# EAGLE design AHNS_AP_MK4 (EAGLE 5.10)
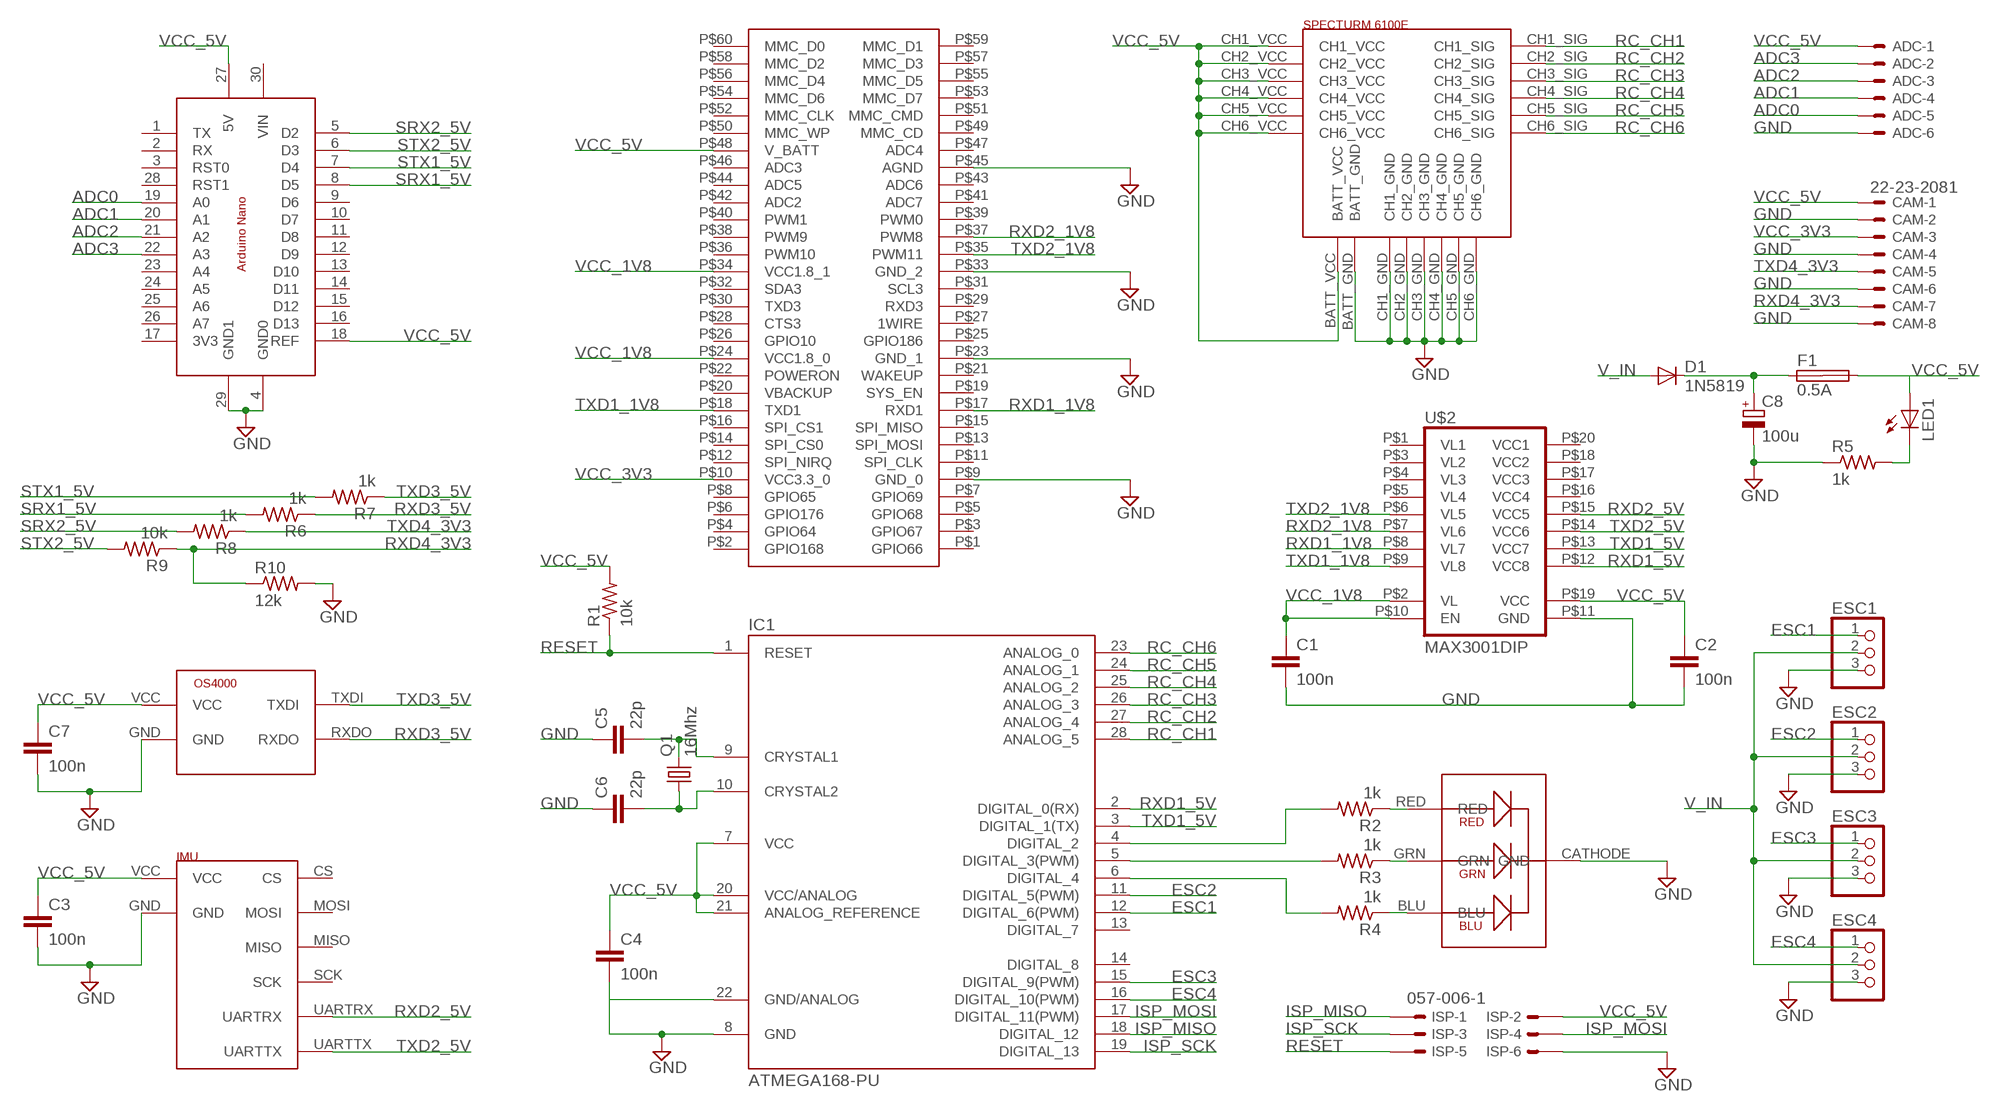
[diagram p0: schematic, sheet 1]

## Parts
ADC  22-23-2061  [22-23-2061]
C1  100n  C-EU050-024X044  [C050-024X044]
C2  100n  C-EU050-024X044  [C050-024X044]
C3  100n  C-EU050-024X044  [C050-024X044]
C4  100n  C-EU050-024X044  [C050-024X044]
C5  22p  C-EU050-024X044  [C050-024X044]
C6  22p  C-EU050-024X044  [C050-024X044]
C7  100n  C-EU050-024X044  [C050-024X044]
C8  100u  CPOL-EUE2.5-5  [E2,5-5]
CAM  22-23-2081  [22-23-2081]
D1  1N5819  1N4004  [DO41-10]
ESC1  PINHD-1X3  [1X03]
ESC2  PINHD-1X3  [1X03]
ESC3  PINHD-1X3  [1X03]
ESC4  PINHD-1X3  [1X03]
F1  0.5A  SHK20L  [SHK20L]
IC1  ATMEGA168-PU  [DIL28-3]
ISP  057-006-1  [057-006-1]
LED1  LED3MM  [LED3MM]
Q1  16Mhz  CRYSTALHC49U70  [HC49U70]
R1  10k  R-US_0207/10  [0207/10]
R2  1k  R-US_0207/10  [0207/10]
R3  1k  R-US_0207/10  [0207/10]
R4  1k  R-US_0207/10  [0207/10]
R5  1k  R-US_0207/10  [0207/10]
R6  1k  R-US_0207/10  [0207/10]
R7  1k  R-US_0207/10  [0207/10]
R8  1k  R-US_0207/10  [0207/10]
R9  10k  R-US_0207/10  [0207/10]
R10  12k  R-US_0207/10  [0207/10]
U$1  PINTO  [PINTO]
U$2  MAX3001DIP  [DIP]
U$3  SEN_DYN_6DOF_IMU  [SEN_DYN_6DOF_IMU]
U$4  SPECTRUM_6100E  [SPECTRUM_6100E]
U$5  TRI_COLOR_LED  [TRI_COLOR_LED]
U$6  ARDUINO_NANO  [ARDUINO_NANO]
U$7  OS4000  [OS4000]

## Nets
ADC0: ADC.5 U$6.19(A0)
ADC1: ADC.4 U$6.20(A1)
ADC2: ADC.3 U$6.21(A2)
ADC3: ADC.2 U$6.22(A3)
ESC1: ESC1.1 IC1.12(DIGITAL_6(PWM))
ESC2: ESC2.1 IC1.11(DIGITAL_5(PWM))
ESC3: ESC3.1 IC1.15(DIGITAL_9(PWM))
ESC4: ESC4.1 IC1.16(DIGITAL_10(PWM))
GND: ADC.6 C1.2 C2.2 C3.2 C4.2 C5.1 C6.1 C7.2 C8.- CAM.2 CAM.4 CAM.6 CAM.8 ESC1.3 ESC2.3 ESC3.3 ESC4.3 IC1.8(GND) IC1.22(GND/ANALOG) ISP.6 R5.1 R10.2 U$1.P$9(GND_0) U$1.P$23(GND_1) U$1.P$33(GND_2) U$1.P$45(AGND) U$2.P$11(GND) U$3.GND U$4.BATT_GND U$4.CH1_GND U$4.CH2_GND U$4.CH3_GND U$4.CH4_GND U$4.CH5_GND U$4.CH6_GND U$5.CATHODE(GND) U$6.4(GND0) U$6.29(GND1) U$7.GND
ISP_MISO: IC1.18(DIGITAL_12) ISP.1
ISP_MOSI: IC1.17(DIGITAL_11(PWM)) ISP.4
ISP_SCK: IC1.19(DIGITAL_13) ISP.3
N$1: C5.2 IC1.9(CRYSTAL1) Q1.2
N$2: R2.1 U$5.RED
N$3: C6.2 IC1.10(CRYSTAL2) Q1.1
N$4: R3.1 U$5.GRN
N$5: R4.1 U$5.BLU
N$6: IC1.5(DIGITAL_3(PWM)) R3.2
N$7: IC1.4(DIGITAL_2) R2.2
N$8: IC1.6(DIGITAL_4) R4.2
N$9: C8.+ D1.C F1.1A
N$10: LED1.K(C) R5.2
RC_CH1: IC1.28(ANALOG_5) U$4.CH1_SIG
RC_CH2: IC1.27(ANALOG_4) U$4.CH2_SIG
RC_CH3: IC1.26(ANALOG_3) U$4.CH3_SIG
RC_CH4: IC1.25(ANALOG_2) U$4.CH4_SIG
RC_CH5: IC1.24(ANALOG_1) U$4.CH5_SIG
RC_CH6: IC1.23(ANALOG_0) U$4.CH6_SIG
RESET: IC1.1(RESET) ISP.5 R1.1
RXD1_1V8: U$1.P$17(RXD1) U$2.P$8(VL7)
RXD1_5V: IC1.2(DIGITAL_0(RX)) U$2.P$12(VCC8)
RXD2_1V8: U$1.P$37(PWM8) U$2.P$7(VL6)
RXD2_5V: U$2.P$15(VCC5) U$3.UARTRX
RXD3_5V: R6.1 U$7.RXDO
RXD4_3V3: CAM.7 R9.1 R10.1
SRX1_5V: R6.2 U$6.8(D5)
SRX2_5V: R8.2 U$6.5(D2)
STX1_5V: R7.2 U$6.7(D4)
STX2_5V: R9.2 U$6.6(D3)
TXD1_1V8: U$1.P$18(TXD1) U$2.P$9(VL8)
TXD1_5V: IC1.3(DIGITAL_1(TX)) U$2.P$13(VCC7)
TXD2_1V8: U$1.P$35(PWM11) U$2.P$6(VL5)
TXD2_5V: U$2.P$14(VCC6) U$3.UARTTX
TXD3_5V: R7.1 U$7.TXDI
TXD4_3V3: CAM.5 R8.1
V_IN: D1.A ESC1.2 ESC2.2 ESC3.2 ESC4.2
VCC_1V8: C1.1 U$1.P$24(VCC1.8_0) U$1.P$34(VCC1.8_1) U$2.P$2(VL) U$2.P$10(EN)
VCC_3V3: CAM.3 U$1.P$10(VCC3.3_0)
VCC_5V: ADC.1 C2.1 C3.1 C4.1 C7.1 CAM.1 F1.2A IC1.7(VCC) IC1.20(VCC/ANALOG) IC1.21(ANALOG_REFERENCE) ISP.2 LED1.A R1.2 U$1.P$48(V_BATT) U$2.P$19(VCC) U$3.VCC U$4.BATT_VCC U$4.CH1_VCC U$4.CH2_VCC U$4.CH3_VCC U$4.CH4_VCC U$4.CH5_VCC U$4.CH6_VCC U$6.18(REF) U$6.27(5V) U$7.VCC
Unconnected: F1.1B F1.2B IC1.13(DIGITAL_7) IC1.14(DIGITAL_8) U$1.P$1(GPIO66) U$1.P$2(GPIO168) U$1.P$3(GPIO67) U$1.P$4(GPIO64) U$1.P$5(GPIO68) U$1.P$6(GPIO176) U$1.P$7(GPIO69) U$1.P$8(GPIO65) U$1.P$11(SPI_CLK) U$1.P$12(SPI_NIRQ) U$1.P$13(SPI_MOSI) U$1.P$14(SPI_CS0) U$1.P$15(SPI_MISO) U$1.P$16(SPI_CS1) U$1.P$19(SYS_EN) U$1.P$20(VBACKUP) U$1.P$21(WAKEUP) U$1.P$22(POWERON) U$1.P$25(GPIO186) U$1.P$26(GPIO10) U$1.P$27(1WIRE) U$1.P$28(CTS3) U$1.P$29(RXD3) U$1.P$30(TXD3) U$1.P$31(SCL3) U$1.P$32(SDA3) U$1.P$36(PWM10) U$1.P$38(PWM9) U$1.P$39(PWM0) U$1.P$40(PWM1) U$1.P$41(ADC7) U$1.P$42(ADC2) U$1.P$43(ADC6) U$1.P$44(ADC5) U$1.P$46(ADC3) U$1.P$47(ADC4) U$1.P$49(MMC_CD) U$1.P$50(MMC_WP) U$1.P$51(MMC_CMD) U$1.P$52(MMC_CLK) U$1.P$53(MMC_D7) U$1.P$54(MMC_D6) U$1.P$55(MMC_D5) U$1.P$56(MMC_D4) U$1.P$57(MMC_D3) U$1.P$58(MMC_D2) U$1.P$59(MMC_D1) U$1.P$60(MMC_D0) U$2.P$1(VL1) U$2.P$3(VL2) U$2.P$4(VL3) U$2.P$5(VL4) U$2.P$16(VCC4) U$2.P$17(VCC3) U$2.P$18(VCC2) U$2.P$20(VCC1) U$3.CS U$3.MISO U$3.MOSI U$3.SCK U$6.1(TX) U$6.2(RX) U$6.3(RST0) U$6.9(D6) U$6.10(D7) U$6.11(D8) U$6.12(D9) U$6.13(D10) U$6.14(D11) U$6.15(D12) U$6.16(D13) U$6.17(3V3) U$6.23(A4) U$6.24(A5) U$6.25(A6) U$6.26(A7) U$6.28(RST1) U$6.30(VIN)

## Library data of the parts
ADC = con-molex:22-23-2061: .100" (2.54mm) Center Header - 6 Pin
C1-C7 = rcl:C-EU: CAPACITOR, European symbol
C8 = rcl:CPOL-EU: POLARIZED CAPACITOR, European symbol
CAM = con-molex:22-23-2081: .100" (2.54mm) Center Header - 8 Pin
D1 = diode:1N4004: DIODE general purpose rectifier, 1 A
ESC1-ESC4 = pinhead:PINHD-1X3: PIN HEADER
F1 = fuse:SHK20L: FUSE HOLDER 5 x 20 mm, SH contact, SHH1 Schukat, E1073 Buerklin
IC1 = Arduino-AVR:ATMEGA168-PU
ISP = con-panduit:057-006-: CONNECTOR 6-pin series 057 contact pc board low profile headers
LED1 = led:LED: LED OSRAM: - CHIPLED LG R971, LG N971, LY N971, LG Q971, LY Q971, LO R971, LY R971 LH N974, LH R974 LS Q976, LO Q976, LY Q976 LO Q996 - Hyper CHIPLED LW Q18S LB Q993, LB Q99A, LB R99A - SideLED LS A670, LO A670, LY A670, LG A670, LP A670 LB A673, LV A673, LT A673, LW A673 LH A674 LY A675 LS A676, LA A676, LO A676, LY A676, LW A676 LS A679, LY A679, LG A679 - Hyper Micro SIDELED® LS Y876, LA Y876, LO Y876, LY Y876 LT Y87S - SmartLED LW L88C, LW L88S LB L89C, LB L89S, LG L890 LS L89K, LO L89K, LY L89K LS L896, LA L896, LO L896, LY L896 - TOPLED LS T670, LO T670, LY T670, LG T670, LP T670 LSG T670, LSP T670, LSY T670, LOP T670, LYG T670 LG T671, LOG T671, LSG T671 LB T673, LV T673, LT T673, LW T673 LH T674 LS T676, LA T676, LO T676, LY T676, LB T676, LH T676, LSB T676, LW T676 LB T67C, LV T67C, LT T67C, LS T67K, LO T67K, LY T67K, LW E67C LS E67B, LA E67B, LO E67B, LY E67B, LB E67C, LV E67C, LT E67C LW T67C LS T679, LY T679, LG T679 LS T770, LO T770, LY T770, LG T770, LP T770 LB T773, LV T773, LT T773, LW T773 LH T774 LS E675, LA E675, LY E675, LS T675 LS T776, LA T776, LO T776, LY T776, LB T776 LHGB T686 LT T68C, LB T68C - Hyper Mini TOPLED® LB M676 - Mini TOPLED Santana® LG M470 LS M47K, LO M47K, LY M47K Source: http://www.osram.convergy.de LUXEON: - LUMILED® LXK2-PW12-R00, LXK2-PW12-S00, LXK2-PW14-U00, LXK2-PW14-V00 LXK2-PM12-R00, LXK2-PM12-S00, LXK2-PM14-U00 LXK2-PE12-Q00, LXK2-PE12-R00, LXK2-PE12-S00, LXK2-PE14-T00, LXK2-PE14-U00 LXK2-PB12-K00, LXK2-PB12-L00, LXK2-PB12-M00, LXK2-PB14-N00, LXK2-PB14-P00, LXK2-PB14-Q00 LXK2-PR12-L00, LXK2-PR12-M00, LXK2-PR14-Q00, LXK2-PR14-R00 LXK2-PD12-Q00, LXK2-PD12-R00, LXK2-PD12-S00 LXK2-PH12-R00, LXK2-PH12-S00 LXK2-PL12-P00, LXK2-PL12-Q00, LXK2-PL12-R00 Source: www.luxeon.com KINGBRIGHT: KA-3528ASYC Source: www.kingbright.com
Q1 = crystal:CRYSTAL: CRYSTAL
R1-R10 = rcl:R-US_: RESISTOR, American symbol
U$1 = AHNS10:PINTO
U$2 = maxim-11:MAX3001DIP
U$3 = AHNS10:SEN_DYN_6DOF_IMU
U$4 = AHNS10:SPECTRUM_6100E
U$5 = AHNS10:TRI_COLOR_LED
U$6 = AHNS10:ARDUINO_NANO
U$7 = AHNS10:OS4000

## Board
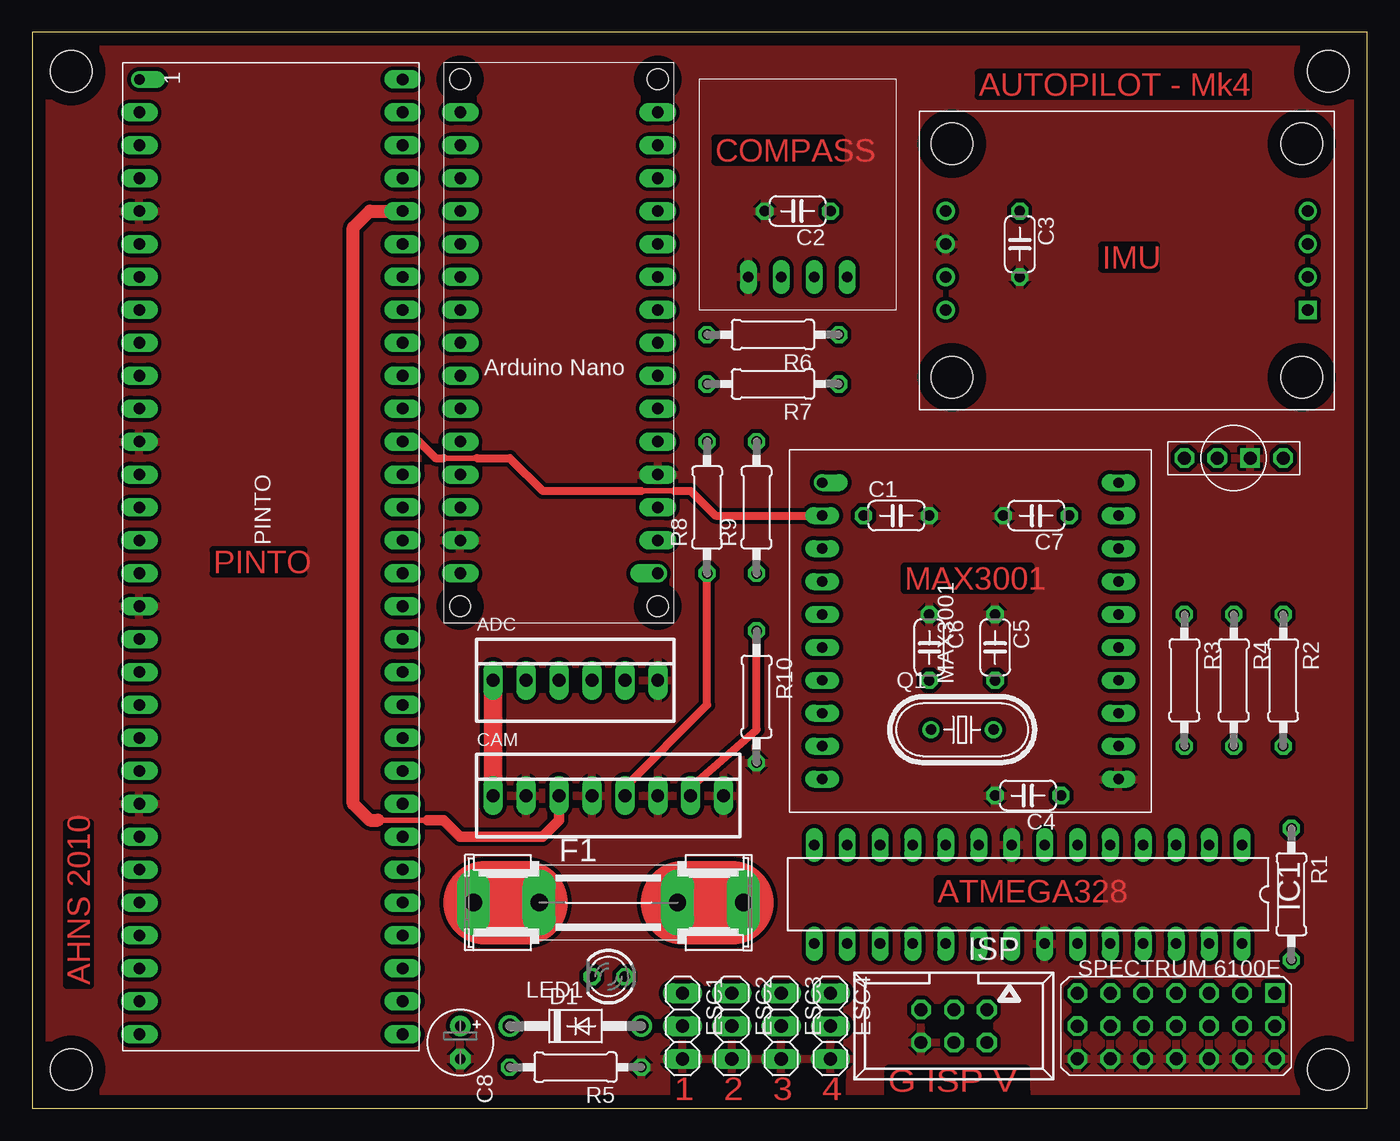
[diagram p1: board, top side]
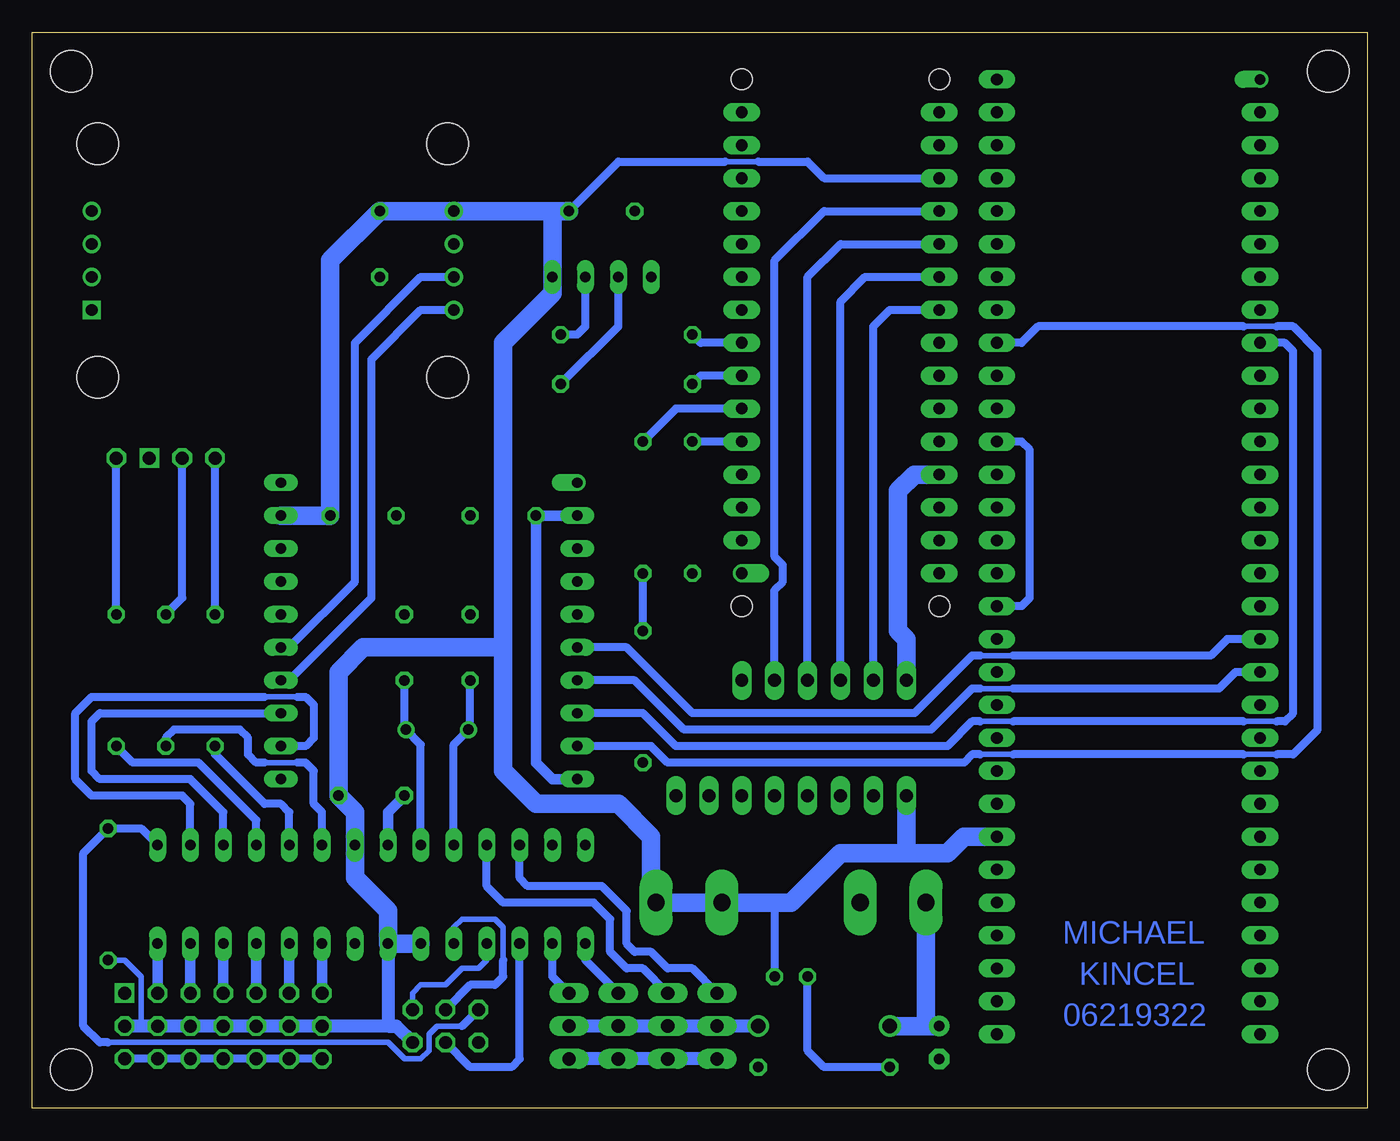
[diagram p2: board, bottom side, seen from below]

Size 103 x 83 mm. Coordinates in mm from the lower left corner, seen from the top.
Outline: 0,0 103,0 103,83 0,83 0,0
Copper layers (1*16): Top 0.035mm / dielectric 1.5mm / Bottom 0.035mm
Design rules "default": minimum track width 10mil, minimum drill 24mil, track to track 8mil, track to pad 8mil, pad to pad 8mil, via to via 8mil, smd to smd 8mil, copper to edge 40mil, drill to drill 8mil, minimum pad ring 10mil, minimum via ring 8mil, stop-mask expansion 4mil, vias tented up to drill 0mil, thermal gap 10mil
Holes 3.2 mm at 3,3 100,3 100,80 3,80

### Footprints (pad centres in the part's own frame; a part is rotated, then mirrored left to right if it is on the bottom)
22-23-2061 = drill 1 long: 1 -6.35,0; 2 -3.81,0; 3 -1.27,0; 4 1.27,0; 5 3.81,0; 6 6.35,0
C050-024X044 = drill 0.813 octagon: 1 -2.54,0; 2 2.54,0
E2,5-5 = drill 0.813 pad 1.6 round: + -1.27,0 | drill 0.813 pad 1.6 octagon: - 1.27,0
22-23-2081 = drill 1 long: 1 -8.89,0; 2 -6.35,0; 3 -3.81,0; 4 -1.27,0; 5 1.27,0; 6 3.81,0; 7 6.35,0; 8 8.89,0
DO41-10 = drill 1.118 round: A 5.08,0; C -5.08,0
1X03 = drill 1.016 long: 1 -2.54,0; 2 0,0; 3 2.54,0
SHK20L = drill 1.321 pad 2.54 long: 1A -10.414,0; 1B -5.334,0; 2A 10.414,0; 2B 5.334,0
DIL28-3 = drill 0.813 long: 1 -16.51,-3.81; 2 -13.97,-3.81; 3 -11.43,-3.81; 4 -8.89,-3.81; 5 -6.35,-3.81; 6 -3.81,-3.81; 7 -1.27,-3.81; 8 1.27,-3.81; 9 3.81,-3.81; 10 6.35,-3.81; 11 8.89,-3.81; 12 11.43,-3.81; 13 13.97,-3.81; 14 16.51,-3.81; 15 16.51,3.81; 16 13.97,3.81; 17 11.43,3.81; 18 8.89,3.81; 19 6.35,3.81; 20 3.81,3.81; 21 1.27,3.81; 22 -1.27,3.81; 23 -3.81,3.81; 24 -6.35,3.81; 25 -8.89,3.81; 26 -11.43,3.81; 27 -13.97,3.81; 28 -16.51,3.81
057-006-1 = drill 1 octagon: 1 -2.54,-1.27; 2 -2.54,1.27; 3 0,-1.27; 4 0,1.27; 5 2.54,-1.27; 6 2.54,1.27
LED3MM = drill 0.813 octagon: A -1.27,0; K 1.27,0
HC49U70 = drill 0.813 round: 1 -2.413,0; 2 2.413,0
0207/10 = drill 0.813 octagon: 1 -5.08,0; 2 5.08,0
PINTO = drill 0.8 offset: P$1 1.27,1.27 | drill 0.9 long: P$2 1.27,21.59; P$3 3.81,1.27; P$4 3.81,21.59; P$5 6.35,1.27; P$6 6.35,21.59; P$7 8.89,1.27; P$8 8.89,21.59; P$9 11.43,1.27; P$10 11.43,21.59; P$11 13.97,1.27; P$12 13.97,21.59; P$13 16.51,1.27; P$14 16.51,21.59; P$15 19.05,1.27; P$16 19.05,21.59; P$17 21.59,1.27; P$18 21.59,21.59; P$19 24.13,1.27; P$20 24.13,21.59; P$21 26.67,1.27; P$22 26.67,21.59; P$23 29.21,1.27; P$24 29.21,21.59; P$25 31.75,1.27; P$26 31.75,21.59; P$27 34.29,1.27; P$28 34.29,21.59; P$29 36.83,1.27; P$30 36.83,21.59; P$31 39.37,1.27; P$32 39.37,21.59; P$33 41.91,1.27; P$34 41.91,21.59; P$35 44.45,1.27; P$36 44.45,21.59; P$37 46.99,1.27; P$38 46.99,21.59; P$39 49.53,1.27; P$40 49.53,21.59; P$41 52.07,1.27; P$42 52.07,21.59; P$43 54.61,1.27; P$44 54.61,21.59; P$45 57.15,1.27; P$46 57.15,21.59; P$47 59.69,1.27; P$48 59.69,21.59; P$49 62.23,1.27; P$50 62.23,21.59; P$51 64.77,1.27; P$52 64.77,21.59; P$53 67.31,1.27; P$54 67.31,21.59; P$55 69.85,1.27; P$56 69.85,21.59; P$57 72.39,1.27; P$58 72.39,21.59; P$59 74.93,1.27; P$60 74.93,21.59
DIP = drill 0.8 offset: P$1 2.54,2.54 | drill 0.8 long: P$2 5.08,2.54; P$3 7.62,2.54; P$4 10.16,2.54; P$5 12.7,2.54; P$6 15.24,2.54; P$7 17.78,2.54; P$8 20.32,2.54; P$9 22.86,2.54; P$10 25.4,2.54; P$11 25.4,25.4; P$12 22.86,25.4; P$13 20.32,25.4; P$14 17.78,25.4; P$15 15.24,25.4; P$16 12.7,25.4; P$17 10.16,25.4; P$18 7.62,25.4; P$19 5.08,25.4; P$20 2.54,25.4
SEN_DYN_6DOF_IMU = drill 0.9 square: CS 13.97,-3.81 | drill 0.9 round: GND -13.97,1.27; MISO 13.97,1.27; MOSI 13.97,-1.27; SCK 13.97,3.81; UARTRX -13.97,-1.27; UARTTX -13.97,-3.81; VCC -13.97,3.81 | hole 3.2: -13.5,-9; 13.5,-9; 13.5,9; -13.5,9
SPECTRUM_6100E = drill 1 octagon: BATT_GND 2.54,7.62; BATT_VCC 0,7.62; CH1_GND 2.54,5.08; CH1_SIG -2.54,5.08; CH1_VCC 0,5.08; CH2_GND 2.54,2.54; CH2_SIG -2.54,2.54; CH2_VCC 0,2.54; CH3_GND 2.54,0; CH3_SIG -2.54,0; CH3_VCC 0,0; CH4_GND 2.54,-2.54; CH4_SIG -2.54,-2.54; CH4_VCC 0,-2.54; CH5_GND 2.54,-5.08; CH5_SIG -2.54,-5.08; CH5_VCC 0,-5.08; CH6_GND 2.54,-7.62; CH6_SIG -2.54,-7.62; CH6_VCC 0,-7.62 | drill 1 square: NC -2.54,7.62
TRI_COLOR_LED = drill 1 octagon: BLU 1.27,0; GRN 3.81,0; RED -3.81,0 | drill 1 square: CATHODE -1.27,0
ARDUINO_NANO = drill 0.9 offset: 1 -7.62,17.78 | drill 0.9 long: 2 -7.62,15.24; 3 -7.62,12.7; 4 -7.62,10.16; 5 -7.62,7.62; 6 -7.62,5.08; 7 -7.62,2.54; 8 -7.62,0; 9 -7.62,-2.54; 10 -7.62,-5.08; 11 -7.62,-7.62; 12 -7.62,-10.16; 13 -7.62,-12.7; 14 -7.62,-15.24; 15 -7.62,-17.78; 16 7.62,-17.78; 17 7.62,-15.24; 18 7.62,-12.7; 19 7.62,-10.16; 20 7.62,-7.62; 21 7.62,-5.08; 22 7.62,-2.54; 23 7.62,0; 24 7.62,2.54; 25 7.62,5.08; 26 7.62,7.62; 27 7.62,10.16; 28 7.62,12.7; 29 7.62,15.24; 30 7.62,17.78 | hole 1.6: -7.62,-20.32; 7.62,-20.32; 7.62,20.32; -7.62,20.32
OS4000 = drill 0.8 long: GND 6.35,-3.81; RXDO 6.35,1.27; TXDI 6.35,-1.27; VCC 6.35,3.81

### Placement (x,y rotation side)
ADC  41.91,33.02 0 top
C1  66.67,45.72 0 top
C2  59.05,69.22 180 top
C3  76.2,66.67 270 top
C4  76.83,24.13 180 top
C5  74.3,35.56 270 top
C6  69.22,35.56 270 top
C7  77.47,45.72 180 top
C8  33.02,5.08 270 top
CAM  44.45,24.13 0 top
D1  41.91,6.35 0 top
ESC1  50.16,6.35 270 top
ESC2  53.98,6.35 270 top
ESC3  57.78,6.35 270 top
ESC4  61.59,6.35 270 top
F1  44.45,15.88 0 top
IC1  76.83,16.51 180 top
ISP  71.12,6.35 180 top
LED1  44.45,10.16 180 top
Q1  71.75,29.21 0 top
R1  97.16,16.51 270 top
R2  96.52,33.02 270 top
R3  88.9,33.02 270 top
R4  92.71,33.02 270 top
R5  41.91,3.17 180 top
R6  57.15,59.69 180 top
R7  57.15,55.88 180 top
R8  52.07,46.35 90 top
R9  55.88,46.35 90 top
R10  55.88,31.75 270 top
U$1  6.99,80.64 270 top
U$2  58.42,50.8 270 top
U$3  84.45,65.41 0 top
U$4  88.27,6.35 270 top
U$5  92.71,50.16 180 top
U$6  40.64,59.05 180 top
U$7  59.05,70.48 270 top

### Tracks (layer width: path | path; a pad name or v marks a point on that pad's centre or on a via)
ADC0
  Bottom 0.61: ADC.5 45.72,40.01 45.09,40.64 45.09,41.91 45.72,42.55 45.72,65.41 41.91,69.22 U$6.19
ADC1
  Bottom 0.61: ADC.4 43.18,64.14 40.64,66.67 U$6.20
ADC2
  Bottom 0.61: ADC.3 40.64,62.23 38.73,64.14 U$6.21
ADC3
  Bottom 0.61: ADC.2 38.1,60.33 36.83,61.59 U$6.22
ESC1
  Bottom 0.61: ESC1.1 52.07,10.79 53.98,10.79 55.24,12.06 56.52,12.06 57.15,12.7 57.15,15.24 59.05,17.14 64.77,17.14 65.41,17.78 IC1.12
ESC2
  Bottom 0.61: IC1.11 67.94,17.14 66.67,15.88 59.69,15.88 58.42,14.61 58.42,12.06 57.15,10.79 55.88,10.79 ESC2.1
ESC3
  Bottom 0.61: ESC3.1 60.33,11.43 IC1.15
ESC4
  Bottom 0.61: ESC4.1 62.87,10.16 IC1.16
GND
  Bottom 0.61: U$4.CH6_GND U$4.CH5_GND U$4.CH4_GND U$4.CH3_GND U$4.CH2_GND U$4.CH1_GND U$4.BATT_GND
  Bottom 0.813: IC1.8 75.56,22.86 C4.2
  Bottom 1.016: ESC4.3 ESC3.3 ESC2.3 ESC1.3
  pour Top (isolate 0.305): 0,0 103,0 103,83 0,83
ISP_MISO
  Bottom 0.406: ISP.1 73.66,8.89 73.03,9.53 71.12,9.53 69.85,10.79 68.58,10.79 67.94,11.43 IC1.18
ISP_MOSI
  Bottom 0.61: ISP.4 69.22,3.17 66.04,3.17 65.41,3.81 IC1.17
ISP_SCK
  Bottom 0.406: 66.67,11.43 66.67,13.97 67.31,14.61 69.85,14.61 70.48,13.97 IC1.19
  Bottom 0.61: ISP.3 69.22,9.53 67.31,9.53 66.67,10.16 66.67,11.43
N$1
  Bottom 0.61: IC1.9 73.03,28.07 Q1.2 74.3,29.21 C5.2
N$2
  Bottom 0.61: R2.1 U$5.RED
N$3
  Bottom 0.61: IC1.10 70.48,28.07 Q1.1 69.22,29.21 C6.2
N$4
  Bottom 0.61: R3.1 U$5.GRN
N$5
  Bottom 0.61: R4.1 91.44,39.37 U$5.BLU
N$6
  Bottom 0.61: IC1.5 83.19,22.86 83.82,23.5 85.09,23.5 88.9,27.3 R3.2
N$7
  Bottom 0.61: IC1.4 85.72,22.23 90.17,26.67 95.25,26.67 R2.2
N$8
  Bottom 0.406: 82.55,26.67 85.09,26.67
  Bottom 0.61: IC1.6 80.64,22.86 81.28,23.5 81.28,26.04 81.92,26.67 82.55,26.67 | 85.09,26.67 85.72,26.67 86.36,27.3 86.36,28.57 87,29.21 92.08,29.21 92.71,28.57 R4.2
N$9
  Bottom 1.422: C8.+ 34.29,6.35 | 34.29,6.35 D1.C | F1.1A 34.04,6.6 34.29,6.35
N$10
  Bottom 0.61: LED1.K 43.18,4.45 41.91,3.17 R5.2
N$12
  Top 6.452: 34.92,15.88 38.1,15.88
N$13
  Top 6.452: 50.16,15.88 53.98,15.88
RC_CH1
  Bottom 0.813: U$4.CH1_SIG IC1.28
RC_CH2
  Bottom 0.813: U$4.CH2_SIG IC1.27
RC_CH3
  Bottom 0.813: U$4.CH3_SIG IC1.26
RC_CH4
  Bottom 0.813: U$4.CH4_SIG IC1.25
RC_CH5
  Bottom 0.813: U$4.CH5_SIG IC1.24
RC_CH6
  Bottom 0.813: U$4.CH6_SIG IC1.23
RESET
  Bottom 0.406: 69.85,6.35 71.75,6.35 72.39,5.71 72.39,4.45 73.03,3.81 74.3,3.81 75.56,5.08 97.16,5.08
  Bottom 0.61: 69.85,6.35 ISP.5 | 97.16,5.08 97.79,5.08 99.06,6.35 99.06,19.68 R1.1 94.61,21.59 IC1.1
RXD1_1V8
  Bottom 0.406: 27.3,29.84 29.84,29.84 | 6.99,29.84 9.53,29.84
  Bottom 0.61: U$2.P$8 55.88,30.48 53.34,27.94 32.38,27.94 30.48,29.84 29.84,29.84 | 9.53,29.84 27.3,29.84 | 6.99,29.84 6.35,29.84 5.71,30.48 5.71,58.42 6.35,59.05 U$1.P$17
RXD1_5V
  Bottom 0.406: 85.09,31.75 82.55,31.75
  Bottom 0.61: U$2.P$12 81.92,27.94 81.28,28.57 81.28,31.11 81.92,31.75 82.55,31.75 | 85.09,31.75 98.42,31.75 99.69,30.48 99.69,25.4 98.42,24.13 91.44,24.13 90.81,23.5 IC1.2
RXD2_1V8
  Bottom 0.406: 27.3,32.38 29.84,32.38
  Bottom 0.61: U$2.P$7 56.52,33.02 52.7,29.21 33.66,29.21 30.48,32.38 29.84,32.38 | U$1.P$37 10.16,33.66 11.43,32.38 27.3,32.38
RXD2_5V
  Bottom 0.61: U$3.UARTRX 73.03,64.14 78.11,59.05 78.11,40.64 83.19,35.56 U$2.P$15
RXD3_5V
  Bottom 0.61: U$7.RXDO 60.33,60.33 60.96,59.69 R6.1
RXD4_3V3
  Top 0.61: CAM.7 50.8,24.77 55.88,29.21 R10.1
  Bottom 0.61: R10.1 R9.1
SRX1_5V
  Bottom 0.61: U$6.8 51.44,59.05 R6.2
SRX2_5V
  Bottom 0.61: U$6.5 R8.2
STX1_5V
  Bottom 0.61: U$6.7 51.44,56.52 R7.2
STX2_5V
  Bottom 0.61: U$6.6 53.34,53.98 R9.2
TXD1_1V8
  Bottom 0.406: 27.3,27.3 29.84,27.3 | 6.99,27.3 9.53,27.3 | 6.99,60.33 9.53,60.33
  Bottom 0.61: U$2.P$9 55.24,27.94 53.98,26.67 31.11,26.67 30.48,27.3 29.84,27.3 | 9.53,27.3 27.3,27.3 | 6.99,27.3 5.71,27.3 3.81,29.21 3.81,58.42 5.71,60.33 6.99,60.33 | 9.53,60.33 25.4,60.33 26.67,59.05 U$1.P$18
TXD1_5V
  Bottom 0.61: U$2.P$13 97.79,30.48 98.42,29.84 98.42,26.04 97.79,25.4 90.81,25.4 88.27,22.86 IC1.3
TXD2_1V8
  Bottom 0.406: 27.3,34.92 29.84,34.92
  Bottom 0.61: U$2.P$6 57.15,35.56 52.07,30.48 34.92,30.48 30.48,34.92 29.84,34.92 | 27.3,34.92 12.06,34.92 10.79,36.2 U$1.P$35
TXD2_5V
  Bottom 0.61: U$2.P$14 83.19,33.02 76.83,39.37 76.83,57.78 73.03,61.59 U$3.UARTTX
TXD3_5V
  Bottom 0.61: U$7.TXDI 57.78,60.33 R7.1
TXD4_3V3
  Top 0.61: CAM.5 45.72,24.77 52.07,31.11 R8.1
V_IN
  Bottom 1.016: ESC4.2 ESC3.2 ESC2.2 ESC1.2 D1.A
VCC_1V8
  Top 0.406: 46.99,47.62 49.53,47.62 | 31.75,50.16 34.29,50.16
  Top 0.61: U$2.P$2 52.7,45.72 50.8,47.62 49.53,47.62 | 46.99,47.62 39.37,47.62 36.83,50.16 34.29,50.16 | 31.75,50.16 31.11,50.16 29.84,51.44 U$1.P$24
  Bottom 0.61: U$1.P$24 26.67,51.44 26.04,50.8 26.04,39.37 26.67,38.73 U$1.P$34
  Bottom 0.813: U$2.P$10 62.87,25.4 64.14,26.67 C1.1 U$2.P$2
VCC_3V3
  Top 0.406: 26.67,22.23 30.48,22.23
  Top 0.813: CAM.3 40.64,22.23 39.37,20.95 33.02,20.95 31.75,22.23 30.48,22.23
  Top 1.016: 26.67,22.23 26.04,22.23 24.77,23.5 24.77,67.94 26.04,69.22 U$1.P$10
VCC_5V
  Top 1.422: CAM.1 ADC.1
  Bottom 0.406: R1.2 95.89,11.43 94.61,10.16 94.61,6.35 | 49.53,73.03 46.99,73.03
  Bottom 0.61: 45.72,15.88 LED1.A | U$6.18 41.91,71.75 43.18,73.03 46.99,73.03 | 49.53,73.03 57.78,73.03 C2.1
  Bottom 1.016: IC1.21 75.56,6.35 | 75.56,6.35 U$4.CH6_VCC U$4.CH5_VCC U$4.CH4_VCC U$4.CH3_VCC U$4.CH2_VCC U$4.CH1_VCC 94.61,6.35 U$4.BATT_VCC | ISP.2 74.93,6.35 75.56,6.35
  Bottom 1.422: IC1.20 IC1.21 75.56,15.24 78.11,17.78 IC1.7 78.11,22.86 C4.1 79.38,33.66 77.47,35.56 66.67,35.56 | 35.56,19.68 32.38,19.68 31.11,20.95 U$1.P$48 | 35.56,19.68 40.64,19.68 44.45,15.88 45.72,15.88 F1.2A 55.24,16.26 55.24,20.95 57.78,23.5 64.14,23.5 66.67,26.04 66.67,35.56 | 35.56,19.68 CAM.1 | ADC.1 35.56,36.2 36.2,36.83 36.2,47.62 34.92,48.9 U$6.27 | 62.87,69.22 C2.1 | 62.87,69.22 U$3.VCC C3.1 80.01,65.41 C7.1 U$2.P$19 | 62.87,69.22 U$7.VCC 62.87,62.87 66.67,59.05 66.67,35.56

### Text on the board
Top: AUTOPILOT - Mk4 | COMPASS | IMU | PINTO | MAX3001 | ATMEGA328 | AHNS 2010 | 1 | 2 | 3 | 4 | G ISP V
Bottom: MICHAEL | KINCEL | 06219322